# Altium schematic sheet SUP_1.5_VTT.SchDoc
size A4
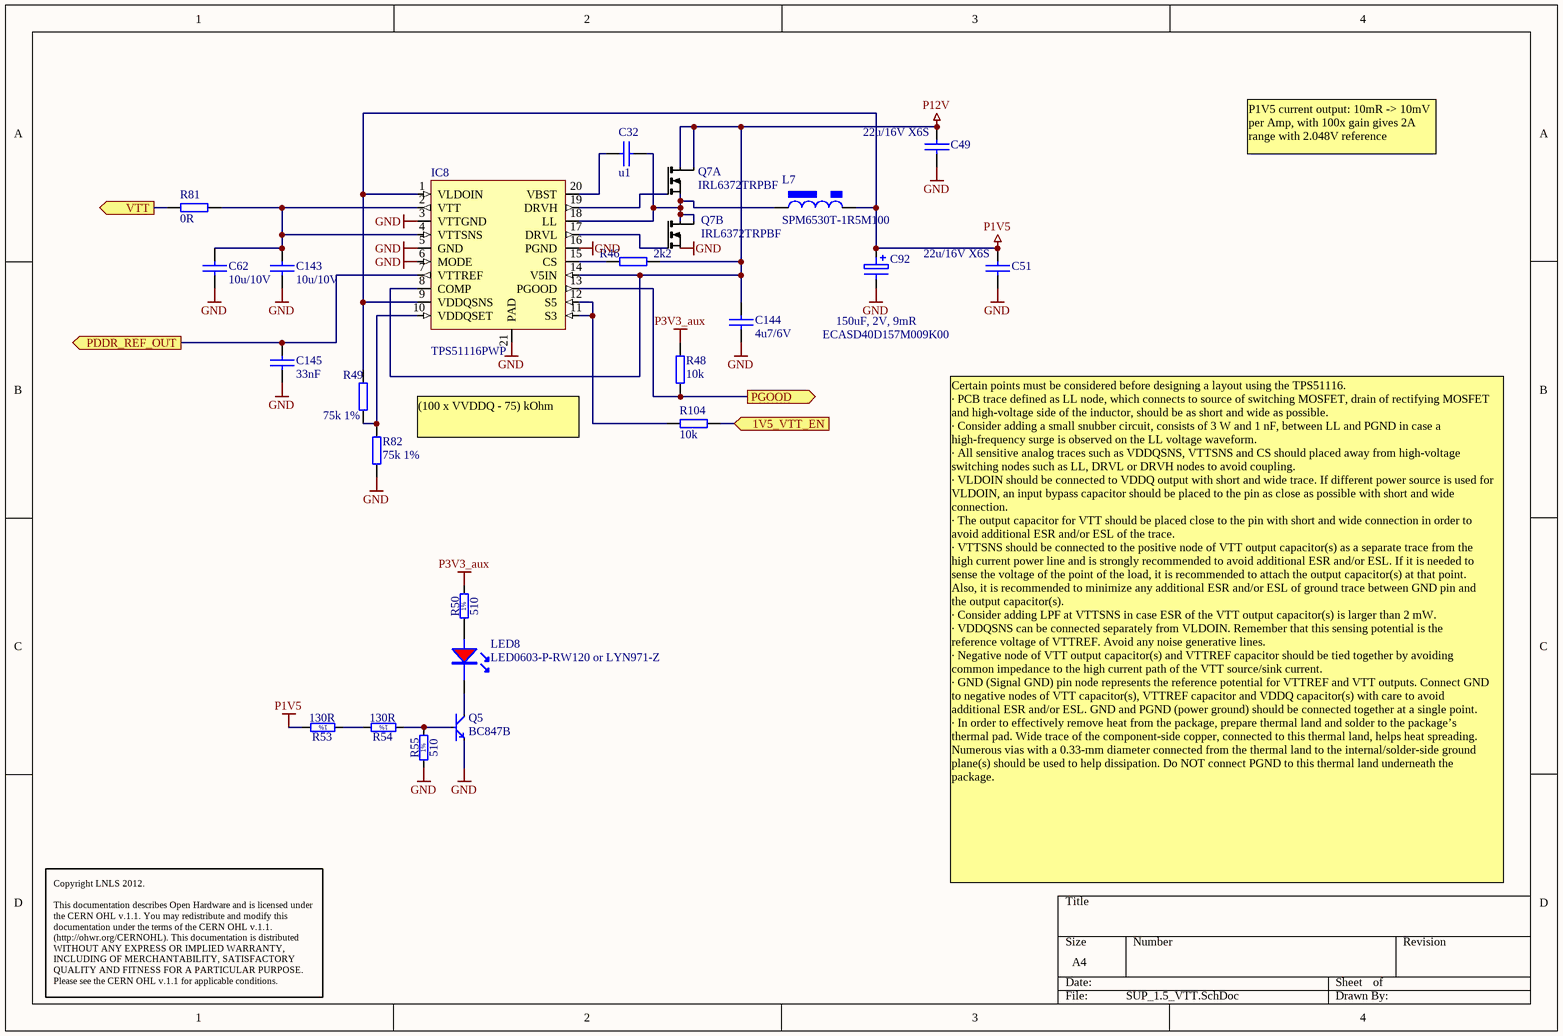
[diagram p0: SUP_1.5_VTT.SchDoc]

## Parts
C32  u1  [0402C]
C49  22u/16V X6S  [1206C]
C51  22u/16V X6S  [1206C]
C62  10u/10V  [0805C]
C92  ECASD40D157M009K00  value 150uF, 2V, 9mR  [2917_POLY]
C143  10u/10V  [0805C]
C144  4u7/6V  [0603C]
C145  33nF  [0603C]
IC8  TPS51116PWP  [TSSOP20-TP]
L7  SPM6530T-1R5M100  [IND_TDK_SPM6530]
LED8  LED0603-P-RW120 or LYN971-Z  [led_0603R]
Q5  BC847B  [SOT-23]
Q7  IRL6372TRPBF  [so-8]  (parts A,B of 2)
R46  2k2  [0402R]
R48  10k  [0402R]
R49  75k 1%  [0603R]
R50  510  [0603R]
R53  130R  [0603R]
R54  130R  [0603R]
R55  510  [0603R]
R81  0R  [0603R]
R82  75k 1%  [0603R]
R104  10k  [0402R]

## Ports
1V5_VTT_EN (in), PDDR_REF_OUT (out), PGOOD (out), VTT (out)

## Nets
GND: C49.2 C51.2 C62.2 C92.2 C143.2 C144.2 C145.2 IC8.3(VTTGND) IC8.5(GND) IC8.6(MODE) IC8.16(PGND) IC8.21(PAD) Q5.2(E) Q7.3(S2) R55.1 R82.1
P1V5: C51.1 C92.1 IC8.1(VLDOIN) IC8.9(VDDQSNS) L7.2 R49.1 R53.2
P3V3_aux: R48.2 R50.2
P12V: C49.1 C144.1 IC8.8(COMP) IC8.14(V5IN) Q7.7(D1) Q7.8(D1) R46.2
1V5_VTT_EN: R104.2 ; port 1V5_VTT_EN
PDDR_REF_OUT: C145.1 IC8.7(VTTREF) ; port PDDR_REF_OUT
PGOOD: IC8.13(PGOOD) R48.1 ; port PGOOD
VTT: R81.1 ; port VTT
NetC32_1: C32.1 IC8.20(VBST)
NetC32_2: C32.2 IC8.18(LL) L7.1 Q7.1(S1) Q7.5(D2) Q7.6(D2)
NetC62_1: C62.1 C143.1 IC8.2(VTT) IC8.4(VTTSNS) R81.2
NetIC8_10: IC8.10(VDDQSET) R49.2 R82.2
NetIC8_11: IC8.11(S3) IC8.12(S5) R104.1
NetIC8_15: IC8.15(CS) R46.1
NetIC8_17: IC8.17(DRVL) Q7.4(G2)
NetIC8_19: IC8.19(DRVH) Q7.2(G1)
NetLED8_A: LED8.A R50.1
NetLED8_K: LED8.K Q5.3(C)
NetQ5_1: Q5.1(B) R54.1 R55.2
NetR53_1: R53.1 R54.2

## Notes on the sheet
- P1V5 current output: 10mR -> 10mV per Amp, with 100x gain gives 2A range with 2.048V reference
- (100 x VVDDQ - 75) kOhm
- Certain points must be considered before designing a layout using the TPS51116.
  · PCB trace defined as LL node, which connects to source of switching MOSFET, drain of rectifying MOSFET
  and high-voltage side of the inductor, should be as short and wide as possible.
  · Consider adding a small snubber circuit, consists of 3 W and 1 nF, between LL and PGND in case a
  high-frequency surge is observed on the LL voltage waveform.
  · All sensitive analog traces such as VDDQSNS, VTTSNS and CS should placed away from high-voltage
  switching nodes such as LL, DRVL or DRVH nodes to avoid coupling.
  · VLDOIN should be connected to VDDQ output with short and wide trace. If different power source is used for
  VLDOIN, an input bypass capacitor should be placed to the pin as close as possible with short and wide
  connection.
  · The output capacitor for VTT should be placed close to the pin with short and wide connection in order to
  avoid additional ESR and/or ESL of the trace.
  · VTTSNS should be connected to the positive node of VTT output capacitor(s) as a separate trace from the
  high current power line and is strongly recommended to avoid additional ESR and/or ESL. If it is needed to
  sense the voltage of the point of the load, it is recommended to attach the output capacitor(s) at that point.
  Also, it is recommended to minimize any additional ESR and/or ESL of ground trace between GND pin and
  the output capacitor(s).
  · Consider adding LPF at VTTSNS in case ESR of the VTT output capacitor(s) is larger than 2 mW.
  · VDDQSNS can be connected separately from VLDOIN. Remember that this sensing potential is the
  reference voltage of VTTREF. Avoid any noise generative lines.
  · Negative node of VTT output capacitor(s) and VTTREF capacitor should be tied together by avoiding
  common impedance to the high current path of the VTT source/sink current.
  · GND (Signal GND) pin node represents the reference potential for VTTREF and VTT outputs. Connect GND
  to negative nodes of VTT capacitor(s), VTTREF capacitor and VDDQ capacitor(s) with care to avoid
  additional ESR and/or ESL. GND and PGND (power ground) should be connected together at a single point.
  · In order to effectively remove heat from the package, prepare thermal land and solder to the package’s
  thermal pad. Wide trace of the component-side copper, connected to this thermal land, helps heat spreading.
  Numerous vias with a 0.33-mm diameter connected from the thermal land to the internal/solder-side ground
  plane(s) should be used to help dissipation. Do NOT connect PGND to this thermal land underneath the
  package.
- Copyright LNLS 2012.
  This documentation describes Open Hardware and is licensed under the CERN OHL v.1.1. You may redistribute and modify this documentation under the terms of the CERN OHL v.1.1. (http://ohwr.org/CERNOHL). This documentation is distributed WITHOUT ANY EXPRESS OR IMPLIED WARRANTY, INCLUDING OF MERCHANTABILITY, SATISFACTORY QUALITY AND FITNESS FOR A PARTICULAR PURPOSE. Please see the CERN OHL v.1.1 for applicable conditions.
- (in symbol R0402_510R_1%_0.0625W_100PPM) 1%
- (in symbol R0603_130R_1%_0.1W_100PPM) 1%

## Library data of the parts
C32 = CAP_SMD_0402: Capacitor SMD
C49 C51 = CAP_SMD_1206: Capacitor SMD; Supplier 1: Newark; Supplier Part Number 1: 90R7810
C62 C143 = CAP_SMD_0805: Capacitor SMD
C92 = CAP_POLYMER_SMDD: POLY, 150uF, 2V, ESR: 9mR
C144 C145 = CAP_SMD_0603: Capacitor SMD
IC8 = PM_TPS51116: COMPLETE DDR AND DDR2 MEMORY POWER SOLUTION
L7 = L_POWER_SPM6530T: 1.5uH, 20%, 10mR, 11.5A; Supplier 1: Arrow; Supplier Part Number 1: 51419938S48550N1165
LED8 = LED_0603R: LED 0603 red; Supplier 1: Newark; Supplier Part Number 1: 22M3004; Supplier 2: Newark; Supplier Part Number 2: 20M0618
Q5 = Q_BC847B: Transistor
Q7 = Q_IRL6372: dual NMOS 30V, 8A, 18mR
R46 R48 R104 = RES_0402: SMD Resistor; Supplier 1: Newark; Supplier Part Number 1: 59M6691
R49 R81 R82 = RES_0603: SMD Resistor
R50 R55 = R0402_510R_1%_0.0625W_100PPM: Resistor - 1%; Part Description: General Purpose Thick Film Chip Resistor; Manufacturer: GENERIC; Manufacturer1 Part Number: 232270675101; TC: ±100ppm/°C; Table: Resistors SMD; Part Number: R0402_510R_1%_0.0625W_100PPM; Component Kind: Standard; Component Type: Standard; Footprint: RESC1005X40N; Pin Count: 2; Value: 510; Status: Not recommended; Power: 0.0625W; Tolerance: ±1%; Manufacturer Part Number: R0402_510R_1%_0.0625W_100PPM; Case: 0402; Mounted: Yes; Socket: No; SMD: Yes; Manufacturer1 Example: PHYCOMP; Manufacturer1 ComponentHeight: 0.4mm; HelpURL: \\cern.ch\dfs\Applications\Altium\Datasheets\R0402_Phycomp_RC0402.pdf; Author: CERN DEM JLC; CreateDate: 2007-12-03; LatestRevisionDate: 2008-03-13
R53 R54 = R0603_130R_1%_0.1W_100PPM: Resistor - 1%; Part Description: General Purpose Thick Film Chip Resistor; Manufacturer: GENERIC; Manufacturer1 Part Number: NRC06F1300TRF; Value: 130; Power: 0.1W; TC: ±100ppm/°C; Table: Resistors SMD; Part Number: R0603_130R_1%_0.1W_100PPM; Component Kind: Standard; Component Type: Standard; Footprint: RESC1608X55N; Pin Count: 2; Status: Preferred; Tolerance: ±1%; Manufacturer Part Number: R0603_130R_1%_0.1W_100PPM; Case: 0603; Mounted: Yes; Socket: No; SMD: Yes; Manufacturer1 Example: NIC COMPONENT; Manufacturer1 ComponentHeight: 0.55mm; HelpURL: \\cern.ch\dfs\Applications\Altium\Datasheets\R0603_NIC_NRC.pdf; Author: CERN DEM JLC; CreateDate: 2007-12-03; LatestRevisionDate: 2008-03-13